# Altium schematic sheet Audio.SchDoc
size Letter
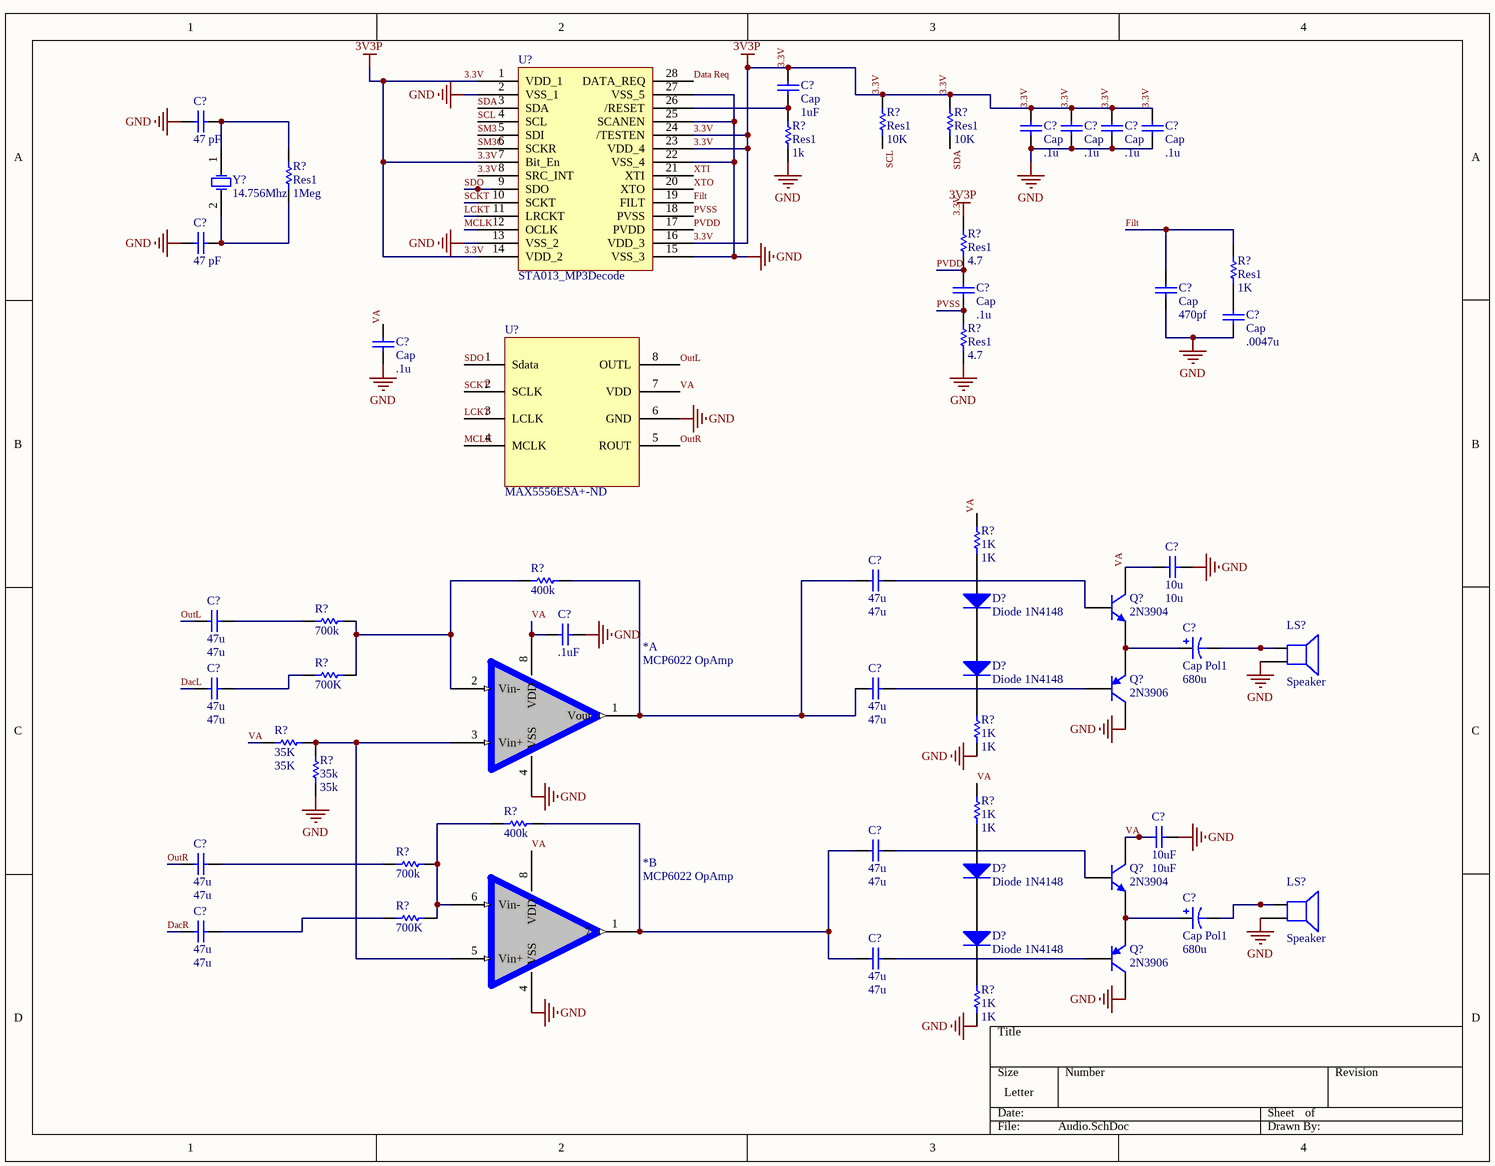
[diagram p0: Audio.SchDoc]

## Parts
(Parts that share a designator on the sheet are numbered #1, #2 ... from top to bottom, then left to right.)
*#1  MCP6022 OpAmp  [SOP8_Opamp]  (part A of 2)
*#2  MCP6022 OpAmp  [SOP8_Opamp]  (part B of 2)
C?#1  Cap  value 1uF  [C0805]
C?#2  47 pF  [C0805]
C?#3  Cap  value .1u  [C0805]
C?#4  Cap  value .1u  [C0805]
C?#5  Cap  value .1u  [C0805]
C?#6  Cap  value .1u  [C0805]
C?#7  47 pF  [C0805]
C?#8  Cap  value .1u  [C0805]
C?#9  Cap  value 470pf  [C0805]
C?#10  Cap  value .0047u  [C0805]
C?#11  Cap  value .1u  [C0805]
C?#12  47u  [C0805]
C?#13  10u  [C0805]
C?#14  47u  [C0805]
C?#15  .1uF  [C0805]
C?#16  Cap Pol1  value 680u  [C2917]
C?#17  47u  [C0805]
C?#18  47u  [C0805]
C?#19  47u  [C0805]
C?#20  47u  [C0805]
C?#21  10uF  [C0805]
C?#22  Cap Pol1  value 680u  [C2917]
C?#23  47u  [C0805]
C?#24  47u  [C0805]
D?#1  Diode 1N4148  [DO-35]
D?#2  Diode 1N4148  [DO-35]
D?#3  Diode 1N4148  [DO-35]
D?#4  Diode 1N4148  [DO-35]
LS?#1  Speaker  [PIN2]
LS?#2  Speaker  [PIN2]
Q?#1  2N3904  [TO-92A]
Q?#2  2N3906  [TO-92A]
Q?#3  2N3904  [TO-92A]
Q?#4  2N3906  [TO-92A]
R?#1  Res1  value 10K  [6-0805_M]
R?#2  Res1  value 10K  [6-0805_M]
R?#3  Res1  value 1k  [6-0805_M]
R?#4  Res1  value 1Meg  [6-0805_M]
R?#5  Res1  value 4.7  [6-0805_M]
R?#6  Res1  value 1K  [6-0805_M]
R?#7  Res1  value 4.7  [6-0805_M]
R?#8  1K  [6-0805_M]
R?#9  400k  [6-0805_M]
R?#10  700k  [6-0805_M]
R?#11  700K  [6-0805_M]
R?#12  1K  [6-0805_M]
R?#13  35K  [6-0805_M]
R?#14  35k  [6-0805_M]
R?#15  1K  [6-0805_M]
R?#16  400k  [6-0805_M]
R?#17  700k  [6-0805_M]
R?#18  700K  [6-0805_M]
R?#19  1K  [6-0805_M]
U?#1  STA013_MP3Decode  [SOP28]
U?#2  MAX5556ESA+-ND  [SOIC8_DAC]
Y?  14.756Mhz  [HC-49U]

## Nets
3.3V: C?#1.1 C?#3.2 C?#4.2 C?#5.2 C?#6.2 R?#1.2 R?#2.2 R?#5.1 U?#1.1(VDD_1) U?#1.7(Bit_En) U?#1.8(SRC_INT) U?#1.14(VDD_2) U?#1.16(VDD_3) U?#1.23(VDD_4) U?#1.24(/TESTEN)  [also labelled 3V3P]
GND: *#1.4(VSS) *#2.4(VSS) C?#2.1 C?#3.1 C?#4.1 C?#5.1 C?#6.1 C?#7.1 C?#9.1 C?#10.1 C?#11.1 C?#13.1 C?#15.2 C?#21.1 LS?#1.2 LS?#2.2 Q?#2.3(C) Q?#4.3(C) R?#3.1 R?#7.2 R?#12.2 R?#14.1 R?#19.2 U?#1.2(VSS_1) U?#1.13(VSS_2) U?#1.15(VSS_3) U?#1.22(VSS_4) U?#1.25(SCANEN) U?#1.27(VSS_5) U?#2.6(GND)
DacL: C?#17.1
DacR: C?#23.1
Data Req: U?#1.28(DATA_REQ)
Filt: C?#9.2 R?#6.1 U?#1.19(FILT)
LCKT: U?#1.11(LRCKT) U?#2.3(LCLK)
MCLK: U?#1.12(OCLK) U?#2.4(MCLK)
OutL: C?#14.1 U?#2.8(OUTL)
OutR: C?#20.1 U?#2.5(ROUT)
PVDD: C?#8.2 R?#5.2 U?#1.17(PVDD)
PVSS: C?#8.1 R?#7.1 U?#1.18(PVSS)
SCKT: U?#1.10(SCKT) U?#2.2(SCLK)
SCL: R?#1.1 U?#1.4(SCL)
SDA: R?#2.1 U?#1.3(SDA)
SDO: U?#1.9(SDO) U?#2.1(Sdata)
SM3: U?#1.5(SDI)
SM3C: U?#1.6(SCKR)
VA: *#1.8(VDD) *#2.8(VDD) C?#11.2 C?#13.2 C?#15.1 C?#21.2 Q?#1.3(C) Q?#3.3(C) R?#8.1 R?#13.1 R?#15.1 U?#2.7(VDD)
XTI: U?#1.21(XTI)
XTO: U?#1.20(XTO)
Net*#1_1: *#1.1(Vout) C?#12.1 C?#18.1 R?#9.2
Net*#1_2: *#1.2(Vin-) R?#9.1 R?#10.2 R?#11.2
Net*#1_3: *#1.3(Vin+) *#2.5(Vin+) R?#13.2 R?#14.2
Net*#2_1: *#2.1(7) C?#19.1 C?#24.1 R?#16.2
Net*#2_6: *#2.6(Vin-) R?#16.1 R?#17.2 R?#18.2
NetC?#1_2: C?#1.2 R?#3.2 U?#1.26(/RESET)
NetC?#2_2: C?#2.2 R?#4.2 Y?.1(OSC1)
NetC?#7_2: C?#7.2 R?#4.1 Y?.2(OSC2)
NetC?#10_2: C?#10.2 R?#6.2
NetC?#12_2: C?#12.2 Q?#1.2(B)
NetC?#14_2: C?#14.2 R?#10.1
NetC?#16_1: C?#16.1 Q?#1.1(E) Q?#2.1(E)
NetC?#16_2: C?#16.2 LS?#1.1
NetC?#17_2: C?#17.2 R?#11.1
NetC?#18_2: C?#18.2 Q?#2.2(B)
NetC?#19_2: C?#19.2 Q?#3.2(B)
NetC?#20_2: C?#20.2 R?#17.1
NetC?#22_1: C?#22.1 Q?#3.1(E) Q?#4.1(E)
NetC?#22_2: C?#22.2 LS?#2.1
NetC?#23_2: C?#23.2 R?#18.1
NetC?#24_2: C?#24.2 Q?#4.2(B)
NetD?#1_1: D?#1.1(A) R?#8.2
NetD?#1_2: D?#1.2(K) D?#2.1(A)
NetD?#2_2: D?#2.2(K) R?#12.1
NetD?#3_1: D?#3.1(A) R?#15.2
NetD?#3_2: D?#3.2(K) D?#4.1(A)
NetD?#4_2: D?#4.2(K) R?#19.1

## Library data of the parts
C?#1-C?#15 C?#17-C?#21 C?#23 C?#24 = Cap: Capacitor; Published: 8-Jun-2000; LatestRevisionDate: 17-Jul-2002; LatestRevisionNote: Re-released for DXP Platform.; PackageReference: RAD-0.3; Publisher: Altium Limited; PackageDescription: Radial Cap, Thru-Hole; 2 Leads; 0.3 in Pin Spacing
  C?#2 C?#7: Value: 47 pF
  C?#12 C?#14 C?#17-C?#20 C?#23 C?#24: Value: 47u
  C?#13: Value: 10u
  C?#15: Value: .1uF
  C?#21: Value: 10uF
C?#16 C?#22 = Cap Pol1: Polarized Capacitor (Radial); Published: 8-Jun-2000; LatestRevisionDate: 17-Jul-2002; LatestRevisionNote: Re-released for DXP Platform.; PackageReference: RB7.6-15; Publisher: Altium Limited; PackageDescription: Polarized Capacitor (Radial); 2 Leads
D?#1-D?#4 = Diode 1N4148: High Conductance Fast Diode; Published: 8-Jun-2000; LatestRevisionDate: 17-Jul-2002; LatestRevisionNote: Re-released for DXP Platform.; DatasheetVersion: 1997; PackageReference: DO-35; Publisher: Altium Limited; PackageDescription: Diode, Axial; Body 3.8 x 1.9 mm (LxDia. max), Lead Dia. 0.53 mm (max); Code_JEDEC: DO-204-AH; ComponentLink1Description: Manufacturer Link; ComponentLink1URL: http://www.fairchildsemi.com/; ComponentLink2Description: Datasheet; ComponentLink2URL: http://www.fairchildsemi.com/ds/1N%2F1N4148.pdf
LS?#1 LS?#2 = Speaker: Loudspeaker; Published: 24-Mar-1999; LatestRevisionDate: 17-Jul-2002; LatestRevisionNote: Re-released for DXP Platform.; PackageReference: PIN2; Publisher: Altium Limited
Q?#1 Q?#3 = 2N3904: NPN General Purpose Amplifier; Published: 8-Jun-2000; LatestRevisionDate: 15-Jan-2003; LatestRevisionNote: PCB Footprint 'BCY-W3/D4.7' replaced; DatasheetVersion: 1997; PackageVersion: Sep-1998; PackageReference: TO-92A; Publisher: Altium Limited; PackageDescription: TO, Flat Index; 3 In-Line, Axial Leads; Body Dia. 4.5mm; Leads 0.51 x 0.48 mm (max); ComponentLink1Description: Manufacturer Link; ComponentLink1URL: http://www.fairchildsemi.com/; ComponentLink2Description: Datasheet; ComponentLink2URL: http://www.fairchildsemi.com/ds/2N%2F2N3904.pdf
Q?#2 Q?#4 = 2N3906: PNP General Purpose Amplifier; Published: 8-Jun-2000; LatestRevisionDate: 15-Jan-2003; LatestRevisionNote: PCB Footprint 'BCY-W3/D4.7' replaced; DatasheetVersion: 1997; PackageVersion: Sep-1998; PackageReference: TO-92A; Publisher: Altium Limited; PackageDescription: TO, Flat Index; 3 In-Line, Axial Leads; Body Dia. 4.5mm; Leads 0.51 x 0.48 mm (max); ComponentLink1Description: Manufacturer Link; ComponentLink1URL: http://www.fairchildsemi.com/; ComponentLink2Description: Datasheet; ComponentLink2URL: http://www.fairchildsemi.com/ds/2N%2F2N3906.pdf
R?#1-R?#19 = Res1: Resistor; Published: 8-Jun-2000; LatestRevisionDate: 17-Jul-2002; LatestRevisionNote: Re-released for DXP Platform.; PackageReference: AXIAL-0.3; Publisher: Altium Limited; PackageDescription: Axial Device, Thru-Hole; 2 Leads; 0.3 in Pin Spacing
  R?#8 R?#12 R?#15 R?#19: Value: 1K
  R?#9 R?#16: Value: 400k
  R?#10 R?#17: Value: 700k
  R?#11 R?#18: Value: 700K
  R?#13: Value: 35K
  R?#14: Value: 35k
Y? = XTAL: Crystal Oscillator; Published: 8-Jun-2000; LatestRevisionDate: 17-Jul-2002; LatestRevisionNote: Re-released for DXP Platform.; PackageReference: R38; Publisher: Altium Limited; PackageDescription: Crystal, Thru-Hole; 2 Leads; Body 3.1 x 8.2 mm (Dia.xH)